# Altium project Flyback.PrjPcb (part 2 of 3)
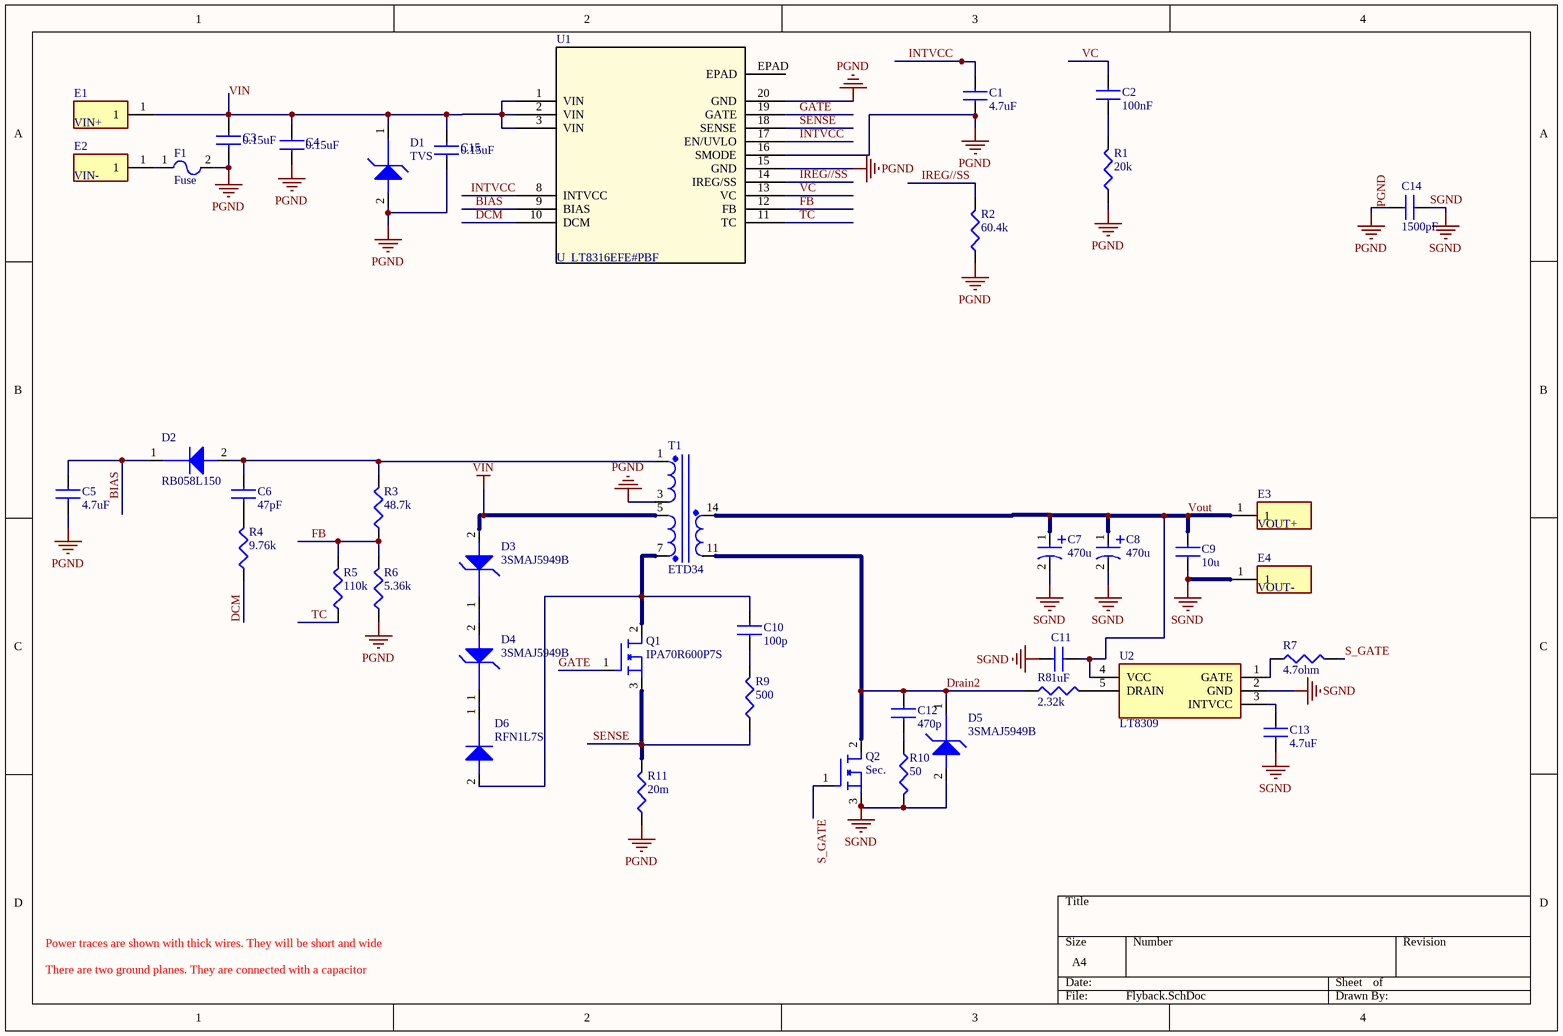
[diagram p1: Flyback.SchDoc]

## Sheet Flyback.SchDoc (continued)
### Library data of the parts
C1 = C_IntVcc: CAP CER 4.7UF 25V X5R 0805 / GRM219R61E475MA73D; Manufacturer: Murata; Tolerance: 20%; Supplier 1: Digi-Key; Supplier Part Number 1: 490-14644-1-ND; Manufacturer Part Number: GRM219R61E475MA73D; RoHS: Yes; Category: Ceramic Capacitors; Stock 1: 107733; Pricing 1: 1=0,28000, 10=0,19400, 50=0,11640, 100=0,09830, 500=0,06728, 1000=0,05951 (USD); Mount: Surface Mount; Case/Package: 0805; Min Operating Temperature: -55°C; Max Operating Temperature: 85°C; Packaging: Tape and Reel; Capacitance: 4.7uF; Voltage Rating: 25V; Voltage Rating (DC): 25V; Dielectric: X5R; Length: 0.079inch; Width: 0.049inch; Thickness: 0.037inch; RoHS Compliant: Yes; ComponentLink1URL: http://search.murata.co.jp/Ceramy/image/img/A01X/G101/ENG/GRM219R61E475MA73-01.pdf?src-supplier=Digi-Key; ComponentLink1Description: http://search.murata.co.jp/Ceramy/image/img/A01X/G101/ENG/GRM219R61E475MA73-01.pdf?src-supplier=Digi-Key; ComponentLink2URL: https://search.murata.co.jp/Ceramy/image/img/A01X/G101/ENG/GRM219R61E475MA73-01.pdf?src-supplier=Digi-Key; ComponentLink2Description: https://search.murata.co.jp/Ceramy/image/img/A01X/G101/ENG/GRM219R61E475MA73-01.pdf?src-supplier=Digi-Key
C2 = C_Vc: CAP CER 0.1UF 25V X7R 0402 / GRM155R71E104KE14J; Manufacturer: Murata; Tolerance: 10%; Supplier 1: Digi-Key; Supplier Part Number 1: 490-14603-1-ND; Manufacturer Part Number: GRM155R71E104KE14J; RoHS: Yes; Category: Capacitors; Stock 1: 1830340; Pricing 1: 1=0,10000, 10=0,02800, 50=0,01520, 100=0,01240, 500=0,00886, 1000=0,00696, 2500=0,00632, 5000=0,00582 (USD); Mount: Surface Mount; Case/Package: 0402; Case Code (Imperial): 0402; Case Code (Metric): 1005; Weight: 0.000212oz; Min Operating Temperature: -55°C; Max Operating Temperature: 125°C; Packaging: Tape and Reel; Capacitance: 100nF; Voltage Rating: 25V; Dielectric: X7R; Termination: SMD/SMT; Resistor Type: Ceramic; Voltage Rating (DC): 25V; Package Quantity: 50000; Length: 0.039inch; Width: 0.5mm; Height: 0.5mm; Thickness: 0.022inch; RoHS Compliant: Yes; ComponentLink1URL: http://www.mouser.com/ds/2/281/c02e-2905.pdf?src-supplier=Mouser; ComponentLink1Description: http://www.mouser.com/ds/2/281/c02e-2905.pdf?src-supplier=Mouser; ComponentLink2URL: http://search.murata.co.jp/Ceramy/image/img/A01X/G101/ENG/GRM155R71E104KE14-01.pdf?src-supplier=Digi-Key; ComponentLink2Description: http://search.murata.co.jp/Ceramy/image/img/A01X/G101/ENG/GRM155R71E104KE14-01.pdf?src-supplier=Digi-Key
C3 C4 C15 = C_Input: CAP CER 0.15UF 500V X7R 1210 / C1210C154KCRACTU; Manufacturer: KEMET; Dielectric Material: Ceramic; Capacitance: 150nF; Tolerance: 10%; Supplier 1: Digi-Key; Supplier Part Number 1: 399-13485-1-ND; Manufacturer Part Number: C1210C154KCRACTU; RoHS: Yes; Category: Ceramic Capacitors; Stock 1: 23364; Pricing 1: 1=0,49000, 10=0,34400, 50=0,26020, 100=0,22660, 500=0,16786, 1000=0,14268 (USD); Mount: Surface Mount; Case/Package: 1210; Case Code (Imperial): 1210; Case Code (Metric): 3225; Min Operating Temperature: -55°C; Max Operating Temperature: 125°C; Dielectric: X7R; Packaging: Tape and Reel; Voltage Rating (DC): 500V; Voltage Rating: 500V; Length: 0.126inch; Width: 0.098inch; Thickness: 0.091inch; RoHS Compliant: Yes; ComponentLink1URL: https://api.kemet.com/component-edge/download/datasheet/C1210C154KCRAC7800.pdf?src-supplier=Digi-Key; ComponentLink1Description: https://api.kemet.com/component-edge/download/datasheet/C1210C154KCRAC7800.pdf?src-supplier=Digi-Key; ComponentLink2URL: http://www.kemet.com/docfinder?Partnumber=C1210C154KCRAC7800&src-supplier=Digi-Key; ComponentLink2Description: http://www.kemet.com/docfinder?Partnumber=C1210C154KCRAC7800&src-supplier=Digi-Key; ComponentLink3URL: http://capacitoredge.kemet.com/capedge2/DataSheet/Datasheet-C1210C154KCRACTU.pdf?pn=C1210C154KCRACTU&src-supplier=Avnet; ComponentLink3Description: http://capacitoredge.kemet.com/capedge2/DataSheet/Datasheet-C1210C154KCRACTU.pdf?pn=C1210C154KCRACTU&src-supplier=Avnet
C5 = C_Bias: CAP CER 4.7UF 35V 10% X5R 0805 / GRM219R6YA475KA73D; Manufacturer: Murata; Material: Ceramic; Supplier 1: Digi-Key; Supplier Part Number 1: 490-7208-1-ND; Manufacturer Part Number: GRM219R6YA475KA73D; RoHS: Yes; Category: Ceramic Capacitors; Stock 1: 73735; Pricing 1: 1=0,26000, 10=0,18100, 50=0,12060, 100=0,10250, 500=0,07234, 1000=0,06330 (USD); Mount: Surface Mount; Case/Package: 0805; Case Code (Metric): 2012; Case Code (Imperial): 0805; Weight: 0.000335oz; Dielectric Material: Ceramic; Min Operating Temperature: -55°C; Max Operating Temperature: 85°C; Voltage Rating: 35V; Tolerance: 10%; Package Quantity: 1; Packaging: Tape and Reel; Capacitance: 4.7uF; Dielectric: X5R; Voltage: 35V; Termination: SMD/SMT; Voltage Rating (DC): 35V; Series: GRM; Length: 2mm; Width: 1.25mm; Height: 0.85mm; Thickness: 0.037inch; Depth: 1.25mm; Lead Free: Lead Free; RoHS Compliant: Yes; ComponentLink1URL: https://datasheet.ciiva.com/14906/partnumbering-e-01-14906486.pdf?src-supplier=Digi-Key; ComponentLink1Description: https://datasheet.ciiva.com/14906/partnumbering-e-01-14906486.pdf?src-supplier=Digi-Key; ComponentLink2URL: https://datasheet.ciiva.com/18697/partnumbering-e-01-18697370.pdf?src-supplier=Digi-Key; ComponentLink2Description: https://datasheet.ciiva.com/18697/partnumbering-e-01-18697370.pdf?src-supplier=Digi-Key
C6 = C_DCM: MURATA - GRM1885C2A470JA01D - SMD Multilayer Ceramic Capacitor, 47 pF, 100 V, 0603 [1608 Metric], ± 5%, C0G / NP0, GRM Series; Voltage Rating: 100V; Temperature Coefficient: 30ppm/°C; Supplier 1: Digi-Key; Supplier Part Number 1: 490-1343-1-ND; Manufacturer: Murata; Manufacturer Part Number: GRM1885C2A470JA01D; RoHS: Yes; Category: Capacitors; Stock 1: 150902; Pricing 1: 1=0,11000, 10=0,07600, 50=0,04340, 100=0,03590, 500=0,02516, 1000=0,02083 (USD); Mount: Surface Mount; Case/Package: 0603; Case Code (Metric): 1608; Case Code (Imperial): 0603; Material: Ceramic; Min Operating Temperature: -55°C; Max Operating Temperature: 125°C; Package Quantity: 1; Capacitance: 47pF; Tolerance: 5%; Packaging: Tape and Reel; Voltage Rating (DC): 100V; Dielectric: C0G; Termination: SMD/SMT; Voltage: 100V; Series: GRM; Construction: Flat; Length: 1.6mm; Width: 0.031inch; Height: 0.8mm; Thickness: 0.035inch; Depth: 0.8mm; Radiation Hardening: No; REACH SVHC: No SVHC; Lead Free: Lead Free; RoHS Compliant: Yes; ComponentLink1URL: https://datasheet.ciiva.com/132/product-132289.pdf?src-supplier=Digi-Key; ComponentLink1Description: https://datasheet.ciiva.com/132/product-132289.pdf?src-supplier=Digi-Key; ComponentLink2URL: https://datasheet.ciiva.com/11786/0900766b80ef921d-11786149.pdf?src-supplier=RSComponents; ComponentLink2Description: https://datasheet.ciiva.com/11786/0900766b80ef921d-11786149.pdf?src-supplier=RSComponents; ComponentLink3URL: https://datasheet.ciiva.com/18101/getdatasheetpartid-37998-18101094.pdf?src-supplier=Verical; ComponentLink3Description: https://datasheet.ciiva.com/18101/getdatasheetpartid-37998-18101094.pdf?src-supplier=Verical; ComponentLink4URL: https://datasheet.ciiva.com/29202/451301-da-01-en-vs-kondensator-0603-29202381.pdf?src-supplier=Conrad; ComponentLink4Description: https://datasheet.ciiva.com/29202/451301-da-01-en-vs-kondensator-0603-29202381.pdf?src-supplier=Conrad; ComponentLink5URL: https://datasheet.ciiva.com/132/partnumbering-e-01-132290.pdf?src-supplier=Digi-Key; ComponentLink5Description: https://datasheet.ciiva.com/132/partnumbering-e-01-132290.pdf?src-supplier=Digi-Key; ComponentLink6URL: https://datasheet.ciiva.com/132/partnumbering-e-01-132291.pdf?src-supplier=Digi-Key; ComponentLink6Description: https://datasheet.ciiva.com/132/partnumbering-e-01-132291.pdf?src-supplier=Digi-Key; ComponentLink7URL: https://datasheet.ciiva.com/5424/product-5424681.pdf?src-supplier=Mouser; ComponentLink7Description: https://datasheet.ciiva.com/5424/product-5424681.pdf?src-supplier=Mouser; ComponentLink8URL: https://datasheet.ciiva.com/11463/product-11463932.pdf?src-supplier=Avnet; ComponentLink8Description: https://datasheet.ciiva.com/11463/product-11463932.pdf?src-supplier=Avnet; ComponentLink9URL: https://datasheet.ciiva.com/16497/product-16497070.pdf?src-supplier=Future+Electronics; ComponentLink9Description: https://datasheet.ciiva.com/16497/product-16497070.pdf?src-supplier=Future+Electronics
C7 C8 = C_OUT_470u: Solid Polymer Aluminum, Radial, Output Capacitor / A750EQ477M1CAAE015; Manufacturer: KEMET; Supplier 1: Digi-Key; Supplier Part Number 1: 399-A750EQ477M1CAAE015-ND; Manufacturer Part Number: A750EQ477M1CAAE015; Stock 1: 1592; Pricing 1: 1=0,53000, 10=0,37700, 50=0,28520, 100=0,24840, 500=0,18400, 1000=0,15640, 2500=0,14720, 5000=0,13800 (USD)
C9 = C_OUT_10u: MURATA - GRM21BR61E106MA73L - SMD Multilayer Ceramic Capacitor, 10 µF, 25 V, 0805 [2012 Metric], ± 20%, X5R, GRM Series; Capacitance: 10uF; Voltage Rating: 25V; Supplier 1: Digi-Key; Supplier Part Number 1: 490-10748-1-ND; Manufacturer: Murata; Manufacturer Part Number: GRM21BR61E106MA73L; RoHS: Yes; Category: Ceramic Capacitors; Stock 1: 350987; Pricing 1: 1=0,26000, 10=0,17900, 50=0,11960, 100=0,10170, 500=0,07176, 1000=0,06279 (USD); Mount: Surface Mount; Case/Package: 0805; Case Code (Metric): 2012; Case Code (Imperial): 0805; Weight: 0.000335oz; Min Operating Temperature: -55°C; Max Operating Temperature: 85°C; Tolerance: 20%; Packaging: Tape and Reel; Dielectric: X5R; Termination: SMD/SMT; Resistor Type: Ceramic; Voltage Rating (DC): 25V; Package Quantity: 3000; Length: 2mm; Width: 0.049inch; Height: 1.25mm; Thickness: 0.055inch; Depth: 1.25mm; REACH SVHC: No SVHC; Lead Free: Lead Free; RoHS Compliant: Yes; ComponentLink1URL: http://www.farnell.com/datasheets/2079185.pdf?src-supplier=Farnell; ComponentLink1Description: http://www.farnell.com/datasheets/2079185.pdf?src-supplier=Farnell; ComponentLink2URL: http://www.mouser.com/ds/2/281/c02e-2905.pdf?src-supplier=Mouser; ComponentLink2Description: http://www.mouser.com/ds/2/281/c02e-2905.pdf?src-supplier=Mouser; ComponentLink3URL: http://components.arrow.com/part/dataview/0323_03061623?src-supplier=Arrow+Europe; ComponentLink3Description: http://components.arrow.com/part/dataview/0323_03061623?src-supplier=Arrow+Europe; ComponentLink4URL: https://search.murata.co.jp/Ceramy/image/img/A01X/G101/ENG/GRM21BR61E106MA73-01.pdf?src-supplier=Digi-Key; ComponentLink4Description: https://search.murata.co.jp/Ceramy/image/img/A01X/G101/ENG/GRM21BR61E106MA73-01.pdf?src-supplier=Digi-Key; ComponentLink5URL: http://www.farnell.com/datasheets/2079185.pdf?src-supplier=Element14; ComponentLink5Description: http://www.farnell.com/datasheets/2079185.pdf?src-supplier=Element14
C10 = C_Snub_Pri: CAP CER 100PF 630V C0G/NP0 1206 / GRM31A5C2J101JW01D; Manufacturer: Murata; Tolerance: 10%; Dielectric: C0G; Voltage: 500V; Temperature Coefficient: 30ppm/°C; Supplier 1: Digi-Key; Supplier Part Number 1: 490-5273-1-ND; Manufacturer Part Number: GRM31A5C2J101JW01D; RoHS: Yes; Category: Ceramic Capacitors; Stock 1: 140494; Pricing 1: 1=0,48000, 10=0,33300, 50=0,23340, 100=0,20000, 500=0,14998, 1000=0,12665 (USD); Mount: Surface Mount; Case/Package: 1206; Case Code (Imperial): 1206; Case Code (Metric): 3216; Min Operating Temperature: -55°C; Max Operating Temperature: 125°C; Capacitance: 100pF; Voltage Rating: 630V; Packaging: Tape and Reel; Voltage Rating (DC): 630V; Package Quantity: 1; Termination: SMD/SMT; Series: GRM; Construction: Flat; Length: 3.2mm; Width: 1.6mm; Height: 1mm; Thickness: 0.039inch; Depth: 1.6mm; Radiation Hardening: No; REACH SVHC: No SVHC; Lead Free: Lead Free; RoHS Compliant: Yes; ComponentLink1URL: https://datasheet.ciiva.com/6173/608985-6173110.pdf?src-supplier=Farnell; ComponentLink1Description: https://datasheet.ciiva.com/6173/608985-6173110.pdf?src-supplier=Farnell; ComponentLink2URL: https://datasheet.ciiva.com/22703/608985-22703466.pdf?src-supplier=Element14; ComponentLink2Description: https://datasheet.ciiva.com/22703/608985-22703466.pdf?src-supplier=Element14; ComponentLink3URL: https://datasheet.ciiva.com/138/partnumbering-e-01-138811.pdf?src-supplier=Digi-Key; ComponentLink3Description: https://datasheet.ciiva.com/138/partnumbering-e-01-138811.pdf?src-supplier=Digi-Key; ComponentLink4URL: https://datasheet.ciiva.com/138/partnumbering-e-01-138812.pdf?src-supplier=Digi-Key; ComponentLink4Description: https://datasheet.ciiva.com/138/partnumbering-e-01-138812.pdf?src-supplier=Digi-Key; ComponentLink5URL: https://datasheet.ciiva.com/138/partnumbering-e-01-138813.pdf?src-supplier=Digi-Key; ComponentLink5Description: https://datasheet.ciiva.com/138/partnumbering-e-01-138813.pdf?src-supplier=Digi-Key; ComponentLink6URL: https://datasheet.ciiva.com/16214/product-16214765.pdf?src-supplier=Future+Electronics; ComponentLink6Description: https://datasheet.ciiva.com/16214/product-16214765.pdf?src-supplier=Future+Electronics
C11 = C_Vcc2: Cap Ceramic 1uF 16V X5R 10% SMD 1206 85°C T/R; Manufacturer: KEMET; Manufacturer Part Number: C1206C105K4PAC7800; Supplier 1: Digi-Key; Supplier Part Number 1: 399-15074-1-ND; RoHS: Yes; Category: Ceramic Capacitors; Stock 1: 698; Pricing 1: 1=0,50000, 10=0,35400, 50=0,26740, 100=0,23290, 500=0,17250, 1000=0,14662 (USD); Mount: Surface Mount; Case/Package: 1206; Min Operating Temperature: -55°C; Max Operating Temperature: 85°C; Packaging: Tape and Reel; Capacitance: 1uF; Tolerance: 10%; Voltage Rating: 16V; RoHS Compliant: Yes; ComponentLink1URL: https://api.kemet.com/component-edge/download/datasheet/C1206C105K4PAC7800.pdf?src-supplier=Digi-Key; ComponentLink1Description: https://api.kemet.com/component-edge/download/datasheet/C1206C105K4PAC7800.pdf?src-supplier=Digi-Key
C12 = C_Snub_Sec: Cap Ceramic 470pF 100V X7R 10% SMD 0402 125C Paper T/R / GRM155R72A471KA01D; Manufacturer: Murata; Supplier 1: Digi-Key; Supplier Part Number 1: 490-6369-1-ND; Manufacturer Part Number: GRM155R72A471KA01D; RoHS: Yes; Category: Ceramic Capacitors; Stock 1: 9964; Pricing 1: 1=0,10000, 10=0,05300, 50=0,02900, 100=0,02370, 500=0,01690, 1000=0,01328, 2500=0,01208, 5000=0,01111 (USD); Mount: Surface Mount; Case/Package: 0402; Case Code (Metric): 1005; Case Code (Imperial): 0402; Min Operating Temperature: -55°C; Max Operating Temperature: 125°C; Capacitance: 470pF; Tolerance: 10%; Package Quantity: 10000; Voltage Rating: 100V; Packaging: Tape and Reel; Voltage Rating (DC): 100V; Dielectric: X7R; Termination: SMD/SMT; Voltage: 100V; Series: GRM; Construction: Flat; Length: 1mm; Width: 0.02inch; Height: 0.5mm; Thickness: 0.022inch; Depth: 0.5mm; Radiation Hardening: No; Lead Free: Lead Free; RoHS Compliant: Yes; ComponentLink1URL: https://datasheet.ciiva.com/6263/product-6263842.pdf?src-supplier=Digi-Key; ComponentLink1Description: https://datasheet.ciiva.com/6263/product-6263842.pdf?src-supplier=Digi-Key; ComponentLink2URL: https://datasheet.ciiva.com/6263/partnumbering-e-01-6263846.pdf?src-supplier=Digi-Key; ComponentLink2Description: https://datasheet.ciiva.com/6263/partnumbering-e-01-6263846.pdf?src-supplier=Digi-Key; ComponentLink3URL: https://datasheet.ciiva.com/11604/product-11604842.pdf?src-supplier=Avnet; ComponentLink3Description: https://datasheet.ciiva.com/11604/product-11604842.pdf?src-supplier=Avnet
C13 = C_IntVcc2: 4.7µF ±10% 10V X7R Ceramic Capacitor -55°C ~ 125°C Surface Mount, MLCC 0805 (2012 Metric) 0.079" L x 0.049" W (2.00mm x 1.25mm); Manufacturer: TDK; Manufacturer Part Number: CGA4J3X7R1A475K125AB; Supplier 1: Digi-Key; Supplier Part Number 1: 445-12730-1-ND; RoHS: Yes; Category: Ceramic Capacitors; Stock 1: 263; Pricing 1: 1=0,27000, 10=0,18200, 50=0,12140, 100=0,10320, 500=0,07286, 1000=0,06376 (USD); Mount: Surface Mount; Case/Package: 0805; Weight: 0.000194oz; Case Code (Imperial): 0805; Case Code (Metric): 2012; Min Operating Temperature: -55°C; Max Operating Temperature: 125°C; Package Quantity: 2000; Packaging: Tape and Reel; Capacitance: 4.7uF; Tolerance: 10%; Voltage Rating: 10V; Dielectric: X7R; Termination: SMD/SMT; Voltage Rating (DC): 10V; Length: 0.079inch; Width: 1.25mm; Height: 1.25mm; Thickness: 0.057inch; Ratings: AEC-Q200; Lead Free: Lead Free; REACH SVHC: No SVHC; ComponentLink1URL: http://www.mouser.com/ds/2/400/lcc_automotive_general_en-843974.pdf?src-supplier=Mouser; ComponentLink1Description: http://www.mouser.com/ds/2/400/lcc_automotive_general_en-843974.pdf?src-supplier=Mouser; ComponentLink2URL: http://www.farnell.com/datasheets/2016103.pdf?src-supplier=Farnell; ComponentLink2Description: http://www.farnell.com/datasheets/2016103.pdf?src-supplier=Farnell; ComponentLink3URL: http://www.farnell.com/datasheets/2016103.pdf?src-supplier=Element14; ComponentLink3Description: http://www.farnell.com/datasheets/2016103.pdf?src-supplier=Element14; ComponentLink4URL: http://product.tdk.com/en/catalog/datasheets/mlcc_automotive_general_en.pdf?src-supplier=Avnet; ComponentLink4Description: http://product.tdk.com/en/catalog/datasheets/mlcc_automotive_general_en.pdf?src-supplier=Avnet; ComponentLink5URL: https://product.tdk.com/info/en/documents/chara_sheet/CGA4J3X7R1A475K125AB.pdf?src-supplier=Digi-Key; ComponentLink5Description: https://product.tdk.com/info/en/documents/chara_sheet/CGA4J3X7R1A475K125AB.pdf?src-supplier=Digi-Key; ComponentLink6URL: https://product.tdk.com/info/en/catalog/datasheets/mlcc_automotive_general_en.pdf?src-supplier=Digi-Key; ComponentLink6Description: https://product.tdk.com/info/en/catalog/datasheets/mlcc_automotive_general_en.pdf?src-supplier=Digi-Key
C14 = C_GND: Ceramic Suppression Cap, 1500PF, X1/Y1 Rohs Compliant: Yes; Manufacturer: Vishay; Manufacturer Part Number: SMDY1152MY5UCR; Supplier 1: Digi-Key; Supplier Part Number 1: 56-SMDY1152MY5UCRTR-ND; Pricing 1: 1000=0,57750 (USD); Category: Capacitors
D1 = D_P4SMA440CA: TVS DIODE 376VWM 602VC SMD; Manufacturer: Littelfuse; Clamping Voltage: 602V; Peak Pulse Power: 400W; Polarity: Bidirectional; Number of Bidirectional Channels: 1; Reverse Standoff Voltage: 376V; Min Breakdown Voltage: 418V; Power Line Protection: No; Peak Pulse Current: 700mA; Max Breakdown Voltage: 462V; Test Current: 1mA; Max Power Dissipation: 3.3W; Leakage Current: 5uA; Voltage Rating (DC): 440V; Diode Type: ZENER; Supplier 1: Digi-Key; Supplier Part Number 1: P4SMA440CACT-ND; Manufacturer Part Number: P4SMA440CA; RoHS: Yes; Category: TVS Diodes; Stock 1: 2778; Pricing 1: 1=0,61000, 10=0,53500, 100=0,41040, 500=0,32444, 1000=0,25955, 2000=0,23522 (USD); Mount: Surface Mount; Case/Package: DO-214AC; Number of Pins: 2; Min Operating Temperature: -65°C; Max Operating Temperature: 150°C; Resistor Type: Zener; Package Quantity: 5000; Direction: Bidirectional; Operating Supply Voltage: 376V; Max Surge Current: 700mA; Packaging: Tape and Reel; Reverse Breakdown Voltage: 418V; Breakdown Voltage: 418V; Number of Channels: 1; Termination: SMD/SMT; Power Dissipation: 400W; Number of Elements: 1; Series: P4SMA; Clamping Voltage-Max: 602V; Length: 5.28mm; Width: 2.79mm; Height: 2.29mm; RoHS Compliant: Yes; REACH SVHC: Unknown; Lead Free: Lead Free; ComponentLink1URL: https://datasheet.ciiva.com/16473/littelfuse-tvs-diodes-p4sma-16473648.pdf?src-supplier=Future+Electronics; ComponentLink1Description: https://datasheet.ciiva.com/16473/littelfuse-tvs-diodes-p4sma-16473648.pdf?src-supplier=Future+Electronics; ComponentLink2URL: https://datasheet.ciiva.com/341/littelfuse-tvs-diode-p4sma-datasheet-pdf-341159.pdf?src-supplier=Digi-Key; ComponentLink2Description: https://datasheet.ciiva.com/341/littelfuse-tvs-diode-p4sma-datasheet-pdf-341159.pdf?src-supplier=Digi-Key; ComponentLink3URL: https://datasheet.ciiva.com/8062/littelfuse-tvs-diodes-p4sma-8062188.pdf?src-supplier=Element14; ComponentLink3Description: https://datasheet.ciiva.com/8062/littelfuse-tvs-diodes-p4sma-8062188.pdf?src-supplier=Element14; ComponentLink4URL: https://datasheet.ciiva.com/341/littelfuse-tvs-diode-p4sma-datasheet-pdf-341160.pdf?src-supplier=Digi-Key; ComponentLink4Description: https://datasheet.ciiva.com/341/littelfuse-tvs-diode-p4sma-datasheet-pdf-341160.pdf?src-supplier=Digi-Key
D2 = D_RB058LAM150TR: Schottky Barrier Diode for general rectification Diode for Bias Pin; Manufacturer: Rohm; Supplier 1: Digi-Key; Supplier Part Number 1: RB058LAM150CT-ND; Manufacturer Part Number: RB058LAM150TR; RoHS: Yes; Stock 1: 50; Pricing 1: 1=0,45000, 10=0,34000, 100=0,21190, 500=0,14500, 1000=0,11154 (USD); RoHS Compliant: Yes; ComponentLink1URL: http://www.farnell.com/datasheets/2646192.pdf?src-supplier=Farnell; ComponentLink1Description: http://www.farnell.com/datasheets/2646192.pdf?src-supplier=Farnell; ComponentLink2URL: http://www.farnell.com/datasheets/2646192.pdf?src-supplier=Element14; ComponentLink2Description: http://www.farnell.com/datasheets/2646192.pdf?src-supplier=Element14; ComponentLink3URL: http://www.farnell.com/datasheets/2646192.pdf?src-supplier=Newark; ComponentLink3Description: http://www.farnell.com/datasheets/2646192.pdf?src-supplier=Newark
D3-D5 = D_3SMAJ5949B-TP: DIODE ZENER 100V 3W DO214AC / 3SMAJ5949B-TPMSCT-ND; Manufacturer: MCC; Tolerance: 5%; Impedance: 250R; Supplier 1: Digi-Key; Supplier Part Number 1: 3SMAJ5949B-TPMSCT-ND; Manufacturer Part Number: 3SMAJ5949B-TP; RoHS: Yes; Category: Zener Diodes; Stock 1: 860; Pricing 1: 1=0,51000, 10=0,41400, 100=0,28160, 500=0,21120, 1000=0,15840, 2000=0,14520 (USD); Mount: Surface Mount; Min Operating Temperature: -55°C; Max Operating Temperature: 150°C; Packaging: Tape and Reel; Package Quantity: 1; Zener Voltage: 100V; Max Power Dissipation: 3W; Series: 3SMAJ594; RoHS Compliant: Yes; ComponentLink1URL: https://datasheet.ciiva.com/6389/3smaj5913b3smaj5956bdo-214ac-6389951.pdf?src-supplier=Digi-Key; ComponentLink1Description: https://datasheet.ciiva.com/6389/3smaj5913b3smaj5956bdo-214ac-6389951.pdf?src-supplier=Digi-Key; ComponentLink2URL: https://datasheet.ciiva.com/6389/3smaj5913b3smaj5956bdo-214ac-6389949.pdf?src-supplier=Digi-Key; ComponentLink2Description: https://datasheet.ciiva.com/6389/3smaj5913b3smaj5956bdo-214ac-6389949.pdf?src-supplier=Digi-Key; ComponentLink3URL: https://datasheet.ciiva.com/6389/3smaj5913b3smaj5956bdo-214ac-6389950.pdf?src-supplier=Digi-Key; ComponentLink3Description: https://datasheet.ciiva.com/6389/3smaj5913b3smaj5956bdo-214ac-6389950.pdf?src-supplier=Digi-Key
D6 = D_RFN1L7SDDTE25: Clamp circuit fast diode; Manufacturer: Rohm; Supplier 1: Digi-Key; Supplier Part Number 1: 846-RFN1L7SDDTE25TR-ND; Manufacturer Part Number: RFN1L7SDDTE25; RoHS: Yes
E1-E4 = Connector: TERM TURRET SINGLE L=5.56MM TIN / 2501-2-00-80-00-00-07-0; Manufacturer: Mill-Max; Gender: Male; Outside Diameter: 3.18mm; Hole Diameter: 0.094inch; Board Thickness: 1.57mm; Mounting Hole Diameter: 2.39mm; Pin Diameter: 0.047inch; Supplier 1: Digi-Key; Supplier Part Number 1: ED90581-ND; Manufacturer Part Number: 2501-2-00-80-00-00-07-0; RoHS: Yes; Category: Terminals; Stock 1: 4209; Pricing 1: 1=0,23000, 10=0,21400, 25=0,18240, 50=0,15940, 100=0,14810, 250=0,13100, 500=0,12530, 1000=0,10252, 2500=0,09397 (USD); Mount: Through Hole; Material: Brass; Plating: Tin; Package Quantity: 500; Packaging: Bulk; Length: 0.328inch; Lead Free: Lead Free; RoHS Compliant: Yes; ComponentLink1URL: https://datasheet.ciiva.com/12487/2501-2-00-80-00-00-07-0-89719-12487471.pdf?src-supplier=Mouser; ComponentLink1Description: https://datasheet.ciiva.com/12487/2501-2-00-80-00-00-07-0-89719-12487471.pdf?src-supplier=Mouser
F1 = Fuse_0751.0110: FUSE CLIP CARTRIDGE 10A PCB / 0751.0110; Manufacturer: Schurter; Material: Bronze,Tin,Brass; Color: Silver; Body Material: Brass; Current Rating: 6.3A; Voltage Rating (DC): 500V; Voltage Rating: 250V; Number of Circuits: 1; Supplier 1: Digi-Key; Supplier Part Number 1: 486-2019-ND; Manufacturer Part Number: 0751.0110; RoHS: Yes; Category: Fuse Holders; Stock 1: 21388; Pricing 1: 1=0,14000, 50=0,10800, 100=0,09700, 500=0,07300, 1000=0,06384 (USD); Mount: Horizontal,PCB,Through Hole; Contact Plating: Tin; Weight: 0.011288oz; Contact Material: Brass; Min Operating Temperature: -40°C; Max Operating Temperature: 85°C; Packaging: Bulk; Voltage Rating (AC): 500V; Package Quantity: 1000; Termination: PC Pin; Voltage: 500V; Fuse Current: 6.3A; Orientation: Horizontal; Length: 5.6mm; Width: 5.6mm; Height: 8.9mm; Depth: 5mm; Radiation Hardening: No; Lead Free: Lead Free; REACH SVHC: No SVHC; ComponentLink1URL: https://datasheet.ciiva.com/16216/629typ-og-clip-5x20-16216705.pdf?src-supplier=Onlinecomponents.com; ComponentLink1Description: https://datasheet.ciiva.com/16216/629typ-og-clip-5x20-16216705.pdf?src-supplier=Onlinecomponents.com; ComponentLink2URL: https://datasheet.ciiva.com/26828/getdatasheetpartid-474345-26828915.pdf?src-supplier=Verical; ComponentLink2Description: https://datasheet.ciiva.com/26828/getdatasheetpartid-474345-26828915.pdf?src-supplier=Verical; ComponentLink3URL: https://datasheet.ciiva.com/14102/zoog-clip-5x20-e-14102795.pdf?src-supplier=Distrelec; ComponentLink3Description: https://datasheet.ciiva.com/14102/zoog-clip-5x20-e-14102795.pdf?src-supplier=Distrelec; ComponentLink4URL: https://datasheet.ciiva.com/30148/54typ-og-clip-5x20-30148507.pdf?src-supplier=Onlinecomponents.com; ComponentLink4Description: https://datasheet.ciiva.com/30148/54typ-og-clip-5x20-30148507.pdf?src-supplier=Onlinecomponents.com; ComponentLink5URL: https://datasheet.ciiva.com/4480/typ-og-clip-5x20-4480442.pdf?src-supplier=Mouser; ComponentLink5Description: https://datasheet.ciiva.com/4480/typ-og-clip-5x20-4480442.pdf?src-supplier=Mouser; ComponentLink6URL: https://datasheet.ciiva.com/3014/typ-og-clip-5x20-3014524.pdf?src-supplier=Avnet; ComponentLink6Description: https://datasheet.ciiva.com/3014/typ-og-clip-5x20-3014524.pdf?src-supplier=Avnet; ComponentLink7URL: https://datasheet.ciiva.com/8036/1712870-8036524.pdf?src-supplier=Element14; ComponentLink7Description: https://datasheet.ciiva.com/8036/1712870-8036524.pdf?src-supplier=Element14; ComponentLink8URL: https://datasheet.ciiva.com/16535/typ-og-clip-5x20-16535885.pdf?src-supplier=Avnet+Europe; ComponentLink8Description: https://datasheet.ciiva.com/16535/typ-og-clip-5x20-16535885.pdf?src-supplier=Avnet+Europe; ComponentLink9URL: https://datasheet.ciiva.com/16326/typ-og-clip-5x20-16326863.pdf?src-supplier=Future+Electronics; ComponentLink9Description: https://datasheet.ciiva.com/16326/typ-og-clip-5x20-16326863.pdf?src-supplier=Future+Electronics
Q1 = Q_IPA70R600P7SXKSA1: Single N-Channel 700V 600 mOhm 10.5 nC CoolMOS Power Mosfet - TO-220-3FP; Manufacturer: Infineon; Continuous Drain Current (ID): 8.5A; Rds On Max: 600mR; Input Capacitance: 364pF; Max Power Dissipation: 25W; Supplier 1: Digi-Key; Supplier Part Number 1: IPA70R600P7SXKSA1-ND; Manufacturer Part Number: IPA70R600P7SXKSA1; RoHS: Yes; Category: MOSFETs; Stock 1: 111; Pricing 1: 1=1,03000, 10=0,91700, 25=0,87000, 100=0,71470, 500=0,59038, 1000=0,47285 (USD); Mount: Through Hole; Case/Package: TO-220-3; Min Operating Temperature: -40°C; Max Operating Temperature: 150°C; Max Dual Supply Voltage: 700V; Drain to Source Voltage (Vdss): 700V; Packaging: Rail/Tube; Lead Free: Lead Free; Halogen Free: Halogen Free; RoHS Compliant: Yes; ComponentLink1URL: https://www.infineon.com/dgdl/Infineon-IPA70R600P7S-DS-v02_00-EN.pdf?fileId=5546d462584d1d4a0158cf80e8880d96&src-supplier=Digi-Key; ComponentLink1Description: https://www.infineon.com/dgdl/Infineon-IPA70R600P7S-DS-v02_00-EN.pdf?fileId=5546d462584d1d4a0158cf80e8880d96&src-supplier=Digi-Key
Q2 = Q_BSC040N10NS5ATMA1: INFINEON - BSC040N10NS5ATMA1 - MOSFET, N-KANAL, 100V, 100A, TDSON; Rds On Max: 4mR; Input Capacitance: 5.3nF; Max Power Dissipation: 2.5W; Turn-On Delay Time: 13ns; Rise Time: 9ns; Turn-Off Delay Time: 32ns; Fall Time: 10ns; Gate to Source Voltage (Vgs): 20V; Element Configuration: Single; Number of Channels: 1; Drain to Source Resistance: 5.6mR; Supplier 1: Digi-Key; Supplier Part Number 1: BSC040N10NS5ATMA1CT-ND; Manufacturer: Infineon; Manufacturer Part Number: BSC040N10NS5ATMA1; RoHS: Yes; Category: MOSFETs; Stock 1: 130; Pricing 1: 1=3,10000, 10=2,78200, 25=2,62480, 100=2,23650, 500=1,83750, 1000=1,75000 (USD); Mount: Surface Mount; Number of Pins: 8; Weight: 0.01787oz; Min Operating Temperature: -55°C; Max Operating Temperature: 150°C; Packaging: Tape and Reel; Drain to Source Voltage (Vdss): 100V; Continuous Drain Current (ID): 100A; Drain to Source Breakdown Voltage: 100V; Package Quantity: 5000; Max Dual Supply Voltage: 100V; RoHS Compliant: Yes; Lead Free: Contains Lead; Halogen Free: Halogen Free; ComponentLink1URL: http://www.mouser.com/ds/2/196/Infineon-BSC040N10NS5-DS-v02_01-EN-531313.pdf?src-supplier=Mouser; ComponentLink1Description: http://www.mouser.com/ds/2/196/Infineon-BSC040N10NS5-DS-v02_01-EN-531313.pdf?src-supplier=Mouser; ComponentLink2URL: http://www.farnell.com/datasheets/2211525.pdf?src-supplier=Farnell; ComponentLink2Description: http://www.farnell.com/datasheets/2211525.pdf?src-supplier=Farnell; ComponentLink3URL: https://www.infineon.com/dgdl/Infineon-BSC040N10NS5-DS-v02_01-EN.pdf?fileId=5546d4624a0bf290014a0fbcee2e6b38&src-supplier=Digi-Key; ComponentLink3Description: https://www.infineon.com/dgdl/Infineon-BSC040N10NS5-DS-v02_01-EN.pdf?fileId=5546d4624a0bf290014a0fbcee2e6b38&src-supplier=Digi-Key; ComponentLink4URL: http://www.infineon.com/dgdl/Infineon-BSC040N10NS5-DS-v02_01-EN.pdf?fileId=5546d4624a0bf290014a0fbcee2e6b38&src-supplier=Digi-Key; ComponentLink4Description: http://www.infineon.com/dgdl/Infineon-BSC040N10NS5-DS-v02_01-EN.pdf?fileId=5546d4624a0bf290014a0fbcee2e6b38&src-supplier=Digi-Key; ComponentLink5URL: http://www.infineon.com/dgdl/Infineon-BSC040N10NS5-DS-v02_00-EN.pdf?fileId=5546d4624a0bf290014a0fbcee2e6b38&src-supplier=Avnet; ComponentLink5Description: http://www.infineon.com/dgdl/Infineon-BSC040N10NS5-DS-v02_00-EN.pdf?fileId=5546d4624a0bf290014a0fbcee2e6b38&src-supplier=Avnet
R1 = R_CVc: D11/CRCW0603-C 100 20K 1% ET1 / CRCW060320K0FKEAC; Manufacturer: Vishay; Power Rating: 100mW; Resistance: 20kR; Temperature Coefficient: 100ppm/°C; Supplier 1: Digi-Key; Supplier Part Number 1: 541-3987-1-ND; Manufacturer Part Number: CRCW060320K0FKEAC; RoHS: Yes; Category: Resistors; Stock 1: 87681; Pricing 1: 1=0,10000, 10=0,03600, 100=0,01450, 1000=0,00652, 2500=0,00566 (USD); Mount: Surface Mount; Case/Package: Molded; Contact Plating: Tin; Min Operating Temperature: -55°C; Max Operating Temperature: 155°C; Tolerance: 1%; Resistor Type: Thick Film; Termination: Wraparound; Length: 1.55mm; Lead Free: Lead Free; RoHS Compliant: Yes; ComponentLink1URL: http://www.vishay.com/docs/28773/crcwce3.pdf?src-supplier=Digi-Key; ComponentLink1Description: http://www.vishay.com/docs/28773/crcwce3.pdf?src-supplier=Digi-Key
R2 = R_IREG//SS: VISHAY - CRCW060360K4FKEA - SMD Chip Resistor, 0603 [1608 Metric], 60.4 kohm, CRCW e3 Series, 75 V, Thick Film, 100 mW; Voltage Rating: 75V; Resistance: 60.4kR; Power Rating: 100mW; Tolerance: 1%; Temperature Coefficient: 100ppm/°C; Supplier 1: Digi-Key; Supplier Part Number 1: 541-60.4KHCT-ND; Manufacturer: Vishay; Manufacturer Part Number: CRCW060360K4FKEA; RoHS: Yes; Category: Resistors; Stock 1: 3660; Pricing 1: 1=0,10000, 10=0,03600, 100=0,01450, 1000=0,00652, 2500=0,00566 (USD); Case/Package: 0603; Weight: 7.1E-05oz; Case Code (Metric): 1608; Case Code (Imperial): 0603; Contact Plating: Tin; Size Code: 0603; Min Operating Temperature: -55°C; Max Operating Temperature: 155°C; Packaging: Tape and Reel; Package Quantity: 10; Resistor Type: Thick Film; Number of Terminations: 2; Termination: SMD/SMT; Max Power Dissipation: 100mW; Voltage Rating (DC): 75V; Features: Automotive AEC-Q200; Series: CRCW; Resistance Tolerance: 1%; Technology: THICK FILM; Construction: Rectangular; Length: 1.55mm; Width: 0.033inch; Height: 0.45mm; Depth: 0.85mm; Radiation Hardening: No; REACH SVHC: Unknown; Military Standard: Not; Lead Free: Lead Free; RoHS Compliant: Yes; ComponentLink1URL: https://datasheet.ciiva.com/11809/0900766b80d98afc-11809685.pdf?src-supplier=RSComponents; ComponentLink1Description: https://datasheet.ciiva.com/11809/0900766b80d98afc-11809685.pdf?src-supplier=RSComponents; ComponentLink2URL: https://datasheet.ciiva.com/7816/1697337-7816053.pdf?src-supplier=Element14; ComponentLink2Description: https://datasheet.ciiva.com/7816/1697337-7816053.pdf?src-supplier=Element14; ComponentLink3URL: https://datasheet.ciiva.com/2494/dcrcwe3-2494471.pdf?src-supplier=Digi-Key; ComponentLink3Description: https://datasheet.ciiva.com/2494/dcrcwe3-2494471.pdf?src-supplier=Digi-Key; ComponentLink4URL: https://datasheet.ciiva.com/16760/70201119-16760503.pdf?src-supplier=Allied+Electronics; ComponentLink4Description: https://datasheet.ciiva.com/16760/70201119-16760503.pdf?src-supplier=Allied+Electronics; ComponentLink5URL: https://datasheet.ciiva.com/2494/dcrcwe3-2494472.pdf?src-supplier=Digi-Key; ComponentLink5Description: https://datasheet.ciiva.com/2494/dcrcwe3-2494472.pdf?src-supplier=Digi-Key; ComponentLink6URL: https://datasheet.ciiva.com/16391/dcrcwe3-16391304.pdf?src-supplier=Future+Electronics; ComponentLink6Description: https://datasheet.ciiva.com/16391/dcrcwe3-16391304.pdf?src-supplier=Future+Electronics; ComponentLink7URL: https://datasheet.ciiva.com/16893/dcrcwe3-16893592.pdf?src-supplier=Avnet+Europe; ComponentLink7Description: https://datasheet.ciiva.com/16893/dcrcwe3-16893592.pdf?src-supplier=Avnet+Europe; ComponentLink8URL: https://datasheet.ciiva.com/2494/dcrcwe3-2494473.pdf?src-supplier=Digi-Key; ComponentLink8Description: https://datasheet.ciiva.com/2494/dcrcwe3-2494473.pdf?src-supplier=Digi-Key; ComponentLink9URL: https://datasheet.ciiva.com/5545/dcrcwe3-109170-5545721.pdf?src-supplier=Mouser; ComponentLink9Description: https://datasheet.ciiva.com/5545/dcrcwe3-109170-5545721.pdf?src-supplier=Mouser; ComponentLink10URL: https://datasheet.ciiva.com/3257/dcrcwe3-3257786.pdf?src-supplier=Avnet; ComponentLink10Description: https://datasheet.ciiva.com/3257/dcrcwe3-3257786.pdf?src-supplier=Avnet; ComponentLink11URL: https://datasheet.ciiva.com/22676/1847332-22676330.pdf?src-supplier=Element14; ComponentLink11Description: https://datasheet.ciiva.com/22676/1847332-22676330.pdf?src-supplier=Element14; ComponentLink12URL: https://datasheet.ciiva.com/3257/dcrcwe3-3257787.pdf?src-supplier=Avnet; ComponentLink12Description: https://datasheet.ciiva.com/3257/dcrcwe3-3257787.pdf?src-supplier=Avnet
R3 = R_FB1: Res Thick Film 0603 48.7K Ohm 1% 0.1W(1/10W) ±100ppm/C Pad SMD Automotive T/R / CRCW060348K7FKEA; Manufacturer: Vishay; Resistance: 48.7kR; Power Rating: 100mW; Voltage Rating: 75V; Temperature Coefficient: 100ppm/°C; Supplier 1: Digi-Key; Supplier Part Number 1: 541-48.7KHCT-ND; Manufacturer Part Number: CRCW060348K7FKEA; RoHS: Yes; Category: Resistors; Stock 1: 2623; Pricing 1: 1=0,10000, 10=0,03600, 100=0,01450, 1000=0,00652, 2500=0,00566 (USD); Case/Package: 0603; Number of Pins: 2; Weight: 7.1E-05oz; Case Code (Metric): 1608; Case Code (Imperial): 0603; Contact Plating: Tin; Size Code: 0603; Min Operating Temperature: -55°C; Max Operating Temperature: 155°C; Package Quantity: 10; Tolerance: 1%; Packaging: Tape and Reel; Resistor Type: Thick Film; Number of Terminations: 2; Termination: SMD/SMT; Max Power Dissipation: 100mW; Features: Automotive AEC-Q200; Series: CRCW; Resistance Tolerance: 1%; Technology: THICK FILM; Construction: Rectangular; Length: 1.55mm; Width: 0.033inch; Height: 0.45mm; Depth: 0.85mm; Radiation Hardening: No; REACH SVHC: Unknown; Military Standard: Not; RoHS Compliant: Yes; ComponentLink1URL: https://datasheet.ciiva.com/3882/41397335s9853079n6892-3882805.pdf?src-supplier=Arrow+Electronics; ComponentLink1Description: https://datasheet.ciiva.com/3882/41397335s9853079n6892-3882805.pdf?src-supplier=Arrow+Electronics; ComponentLink2URL: https://datasheet.ciiva.com/11809/0900766b80d98afc-11809590.pdf?src-supplier=RSComponents; ComponentLink2Description: https://datasheet.ciiva.com/11809/0900766b80d98afc-11809590.pdf?src-supplier=RSComponents; ComponentLink3URL: https://datasheet.ciiva.com/2466/dcrcwe3-2466288.pdf?src-supplier=Digi-Key; ComponentLink3Description: https://datasheet.ciiva.com/2466/dcrcwe3-2466288.pdf?src-supplier=Digi-Key; ComponentLink4URL: https://datasheet.ciiva.com/2466/dcrcwe3-2466289.pdf?src-supplier=Digi-Key; ComponentLink4Description: https://datasheet.ciiva.com/2466/dcrcwe3-2466289.pdf?src-supplier=Digi-Key; ComponentLink5URL: https://datasheet.ciiva.com/16781/70201119-16781510.pdf?src-supplier=Allied+Electronics; ComponentLink5Description: https://datasheet.ciiva.com/16781/70201119-16781510.pdf?src-supplier=Allied+Electronics; ComponentLink6URL: https://datasheet.ciiva.com/7816/1697337-7816039.pdf?src-supplier=Element14; ComponentLink6Description: https://datasheet.ciiva.com/7816/1697337-7816039.pdf?src-supplier=Element14; ComponentLink7URL: https://datasheet.ciiva.com/16449/dcrcwe3-16449495.pdf?src-supplier=Future+Electronics; ComponentLink7Description: https://datasheet.ciiva.com/16449/dcrcwe3-16449495.pdf?src-supplier=Future+Electronics; ComponentLink8URL: https://datasheet.ciiva.com/7816/1697337-7816040.pdf?src-supplier=Element14; ComponentLink8Description: https://datasheet.ciiva.com/7816/1697337-7816040.pdf?src-supplier=Element14; ComponentLink9URL: https://datasheet.ciiva.com/16884/dcrcwe3-16884570.pdf?src-supplier=Avnet+Europe; ComponentLink9Description: https://datasheet.ciiva.com/16884/dcrcwe3-16884570.pdf?src-supplier=Avnet+Europe; ComponentLink10URL: https://datasheet.ciiva.com/5551/dcrcwe3-109170-5551868.pdf?src-supplier=Mouser; ComponentLink10Description: https://datasheet.ciiva.com/5551/dcrcwe3-109170-5551868.pdf?src-supplier=Mouser; ComponentLink11URL: https://datasheet.ciiva.com/3257/dcrcwe3-3257645.pdf?src-supplier=Avnet; ComponentLink11Description: https://datasheet.ciiva.com/3257/dcrcwe3-3257645.pdf?src-supplier=Avnet; ComponentLink12URL: https://datasheet.ciiva.com/22705/1697337-22705853.pdf?src-supplier=Element14; ComponentLink12Description: https://datasheet.ciiva.com/22705/1697337-22705853.pdf?src-supplier=Element14; ComponentLink13URL: https://datasheet.ciiva.com/2466/dcrcwe3-2466287.pdf?src-supplier=Digi-Key; ComponentLink13Description: https://datasheet.ciiva.com/2466/dcrcwe3-2466287.pdf?src-supplier=Digi-Key
R4 = R_DCM: Vishay CRCW Series Thick Film Surface Mount Resistor 0603 Case 9.76k 1% 0.1W 100ppm/K / CRCW06039K76FKEA; Resistance: 9.76kR; Power Rating: 100mW; Voltage Rating: 75V; Temperature Coefficient: 100ppm/°C; Supplier 1: Digi-Key; Supplier Part Number 1: 541-9.76KHCT-ND; Manufacturer: Vishay; Manufacturer Part Number: CRCW06039K76FKEA; RoHS: Yes; Category: Chip SMD Resistors; Stock 1: 4468; Pricing 1: 1=0,10000, 10=0,03600, 100=0,01450, 1000=0,00652, 2500=0,00566 (USD); Case/Package: 0603; Weight: 7.1E-05oz; Case Code (Imperial): 0603; Case Code (Metric): 1608; Contact Plating: Tin; Size Code: 0603; Min Operating Temperature: -55°C; Max Operating Temperature: 155°C; Tolerance: 1%; Packaging: Tape and Reel; Package Quantity: 10; Resistor Type: Thick Film; Number of Terminations: 2; Max Power Dissipation: 100mW; Voltage Rating (DC): 75V; Features: Automotive AEC-Q200; Series: CRCW; Resistance Tolerance: 1%; Construction: Rectangular; Termination: SMD/SMT; Technology: THICK FILM; Length: 1.55mm; Width: 0.85mm; Height: 0.45mm; Depth: 0.85mm; Radiation Hardening: No; REACH SVHC: Unknown; Military Standard: Not; Lead Free: Lead Free; RoHS Compliant: Yes; ComponentLink1URL: https://datasheet.ciiva.com/22872/70201119-22872343.pdf?src-supplier=Allied+Electronics; ComponentLink1Description: https://datasheet.ciiva.com/22872/70201119-22872343.pdf?src-supplier=Allied+Electronics; ComponentLink2URL: https://datasheet.ciiva.com/7792/125364-7792443.pdf?src-supplier=Element14; ComponentLink2Description: https://datasheet.ciiva.com/7792/125364-7792443.pdf?src-supplier=Element14; ComponentLink3URL: https://datasheet.ciiva.com/2466/dcrcwe3-2466253.pdf?src-supplier=Digi-Key; ComponentLink3Description: https://datasheet.ciiva.com/2466/dcrcwe3-2466253.pdf?src-supplier=Digi-Key; ComponentLink4URL: https://datasheet.ciiva.com/7673/1697337-7673325.pdf?src-supplier=Element14; ComponentLink4Description: https://datasheet.ciiva.com/7673/1697337-7673325.pdf?src-supplier=Element14; ComponentLink5URL: https://datasheet.ciiva.com/7673/1697337-7673326.pdf?src-supplier=Element14; ComponentLink5Description: https://datasheet.ciiva.com/7673/1697337-7673326.pdf?src-supplier=Element14; ComponentLink6URL: https://datasheet.ciiva.com/22702/1697337-22702901.pdf?src-supplier=Element14; ComponentLink6Description: https://datasheet.ciiva.com/22702/1697337-22702901.pdf?src-supplier=Element14; ComponentLink7URL: https://datasheet.ciiva.com/5541/dcrcwe3-109170-5541193.pdf?src-supplier=Mouser; ComponentLink7Description: https://datasheet.ciiva.com/5541/dcrcwe3-109170-5541193.pdf?src-supplier=Mouser; ComponentLink8URL: https://datasheet.ciiva.com/2466/dcrcwe3-2466251.pdf?src-supplier=Digi-Key; ComponentLink8Description: https://datasheet.ciiva.com/2466/dcrcwe3-2466251.pdf?src-supplier=Digi-Key; ComponentLink9URL: https://datasheet.ciiva.com/2466/dcrcwe3-2466252.pdf?src-supplier=Digi-Key; ComponentLink9Description: https://datasheet.ciiva.com/2466/dcrcwe3-2466252.pdf?src-supplier=Digi-Key
R5 = R_Tc: RES SMD 110K OHM 5% 1/10W 0603 / CRCW0603110KJNEA; Manufacturer: Vishay Dale; Resistance: 110kR; Power Rating: 100mW; Voltage Rating: 75V; Temperature Coefficient: 200ppm/°C; Supplier 1: Digi-Key; Supplier Part Number 1: 541-110KGCT-ND; Manufacturer Part Number: CRCW0603110KJNEA; RoHS: Yes; Category: Resistors; Stock 1: 16475; Pricing 1: 1=0,10000, 10=0,03200, 100=0,01310, 1000=0,00588, 2500=0,00510 (USD); Case/Package: 0603; Weight: 7.1E-05oz; Case Code (Imperial): 0603; Case Code (Metric): 1608; Contact Plating: Tin; Min Operating Temperature: -55°C; Max Operating Temperature: 155°C; Tolerance: 5%; Packaging: Tape and Reel; Package Quantity: 1; Termination: SMD/SMT; Resistor Type: Thick Film; Number of Terminations: 2; Max Power Dissipation: 100mW; Voltage Rating (DC): 75V; Features: Automotive AEC-Q200; Series: CRCW; Construction: Rectangular; Length: 1.55mm; Width: 0.85mm; Height: 0.02inch; Depth: 0.85mm; Radiation Hardening: No; Military Standard: Not; Lead Free: Lead Free; RoHS Compliant: Yes; ComponentLink1URL: https://datasheet.ciiva.com/3256/dcrcwe3-3256965.pdf?src-supplier=Avnet; ComponentLink1Description: https://datasheet.ciiva.com/3256/dcrcwe3-3256965.pdf?src-supplier=Avnet; ComponentLink2URL: https://datasheet.ciiva.com/5549/dcrcwe3-109170-5549509.pdf?src-supplier=Mouser; ComponentLink2Description: https://datasheet.ciiva.com/5549/dcrcwe3-109170-5549509.pdf?src-supplier=Mouser; ComponentLink3URL: https://datasheet.ciiva.com/2493/dcrcwe3-2493661.pdf?src-supplier=Digi-Key; ComponentLink3Description: https://datasheet.ciiva.com/2493/dcrcwe3-2493661.pdf?src-supplier=Digi-Key; ComponentLink4URL: https://datasheet.ciiva.com/2493/dcrcwe3-2493662.pdf?src-supplier=Digi-Key; ComponentLink4Description: https://datasheet.ciiva.com/2493/dcrcwe3-2493662.pdf?src-supplier=Digi-Key; ComponentLink5URL: https://datasheet.ciiva.com/2493/dcrcwe3-2493663.pdf?src-supplier=Digi-Key; ComponentLink5Description: https://datasheet.ciiva.com/2493/dcrcwe3-2493663.pdf?src-supplier=Digi-Key
R6 = R_FB2: VISHAY         CRCW06035K36FKEA.             SMD Chip Resistor, Thick Film, 5.36 kohm, 75 V, 0603 [1608 Metric], 100 mW,  1%, CRCW Series; Power Rating: 100mW; Voltage Rating: 75V; Resistance: 5.36kR; Temperature Coefficient: 100ppm/°C; Supplier 1: Digi-Key; Supplier Part Number 1: 541-5.36KHCT-ND; Manufacturer: Vishay; Manufacturer Part Number: CRCW06035K36FKEA; RoHS: Yes; Category: Resistors; Stock 1: 42; Pricing 1: 1=0,10000, 10=0,03600, 100=0,01450, 1000=0,00652, 2500=0,00566 (USD); Case/Package: 0603; Number of Pins: 2; Weight: 7.1E-05oz; Case Code (Imperial): 0603; Case Code (Metric): 1608; Contact Plating: Tin; Size Code: 0603; Min Operating Temperature: -55°C; Max Operating Temperature: 155°C; Tolerance: 1%; Packaging: Tape and Reel; Package Quantity: 5000; Resistor Type: Thick Film; Termination: SMD/SMT; Voltage Rating (DC): 75V; Features: Automotive AEC-Q200; Series: CRCW; Max Power Dissipation: 100mW; Number of Terminations: 2; Construction: Rectangular; Technology: THICK FILM; Resistance Tolerance: 1%; Length: 1.55mm; Width: 0.85mm; Height: 0.45mm; Depth: 0.85mm; Radiation Hardening: No; REACH SVHC: No SVHC; Military Standard: Not; Lead Free: Lead Free; RoHS Compliant: Yes; ComponentLink1URL: https://datasheet.ciiva.com/3257/dcrcwe3-3257765.pdf?src-supplier=Avnet; ComponentLink1Description: https://datasheet.ciiva.com/3257/dcrcwe3-3257765.pdf?src-supplier=Avnet; ComponentLink2URL: https://datasheet.ciiva.com/7679/1697337-7679125.pdf?src-supplier=Element14; ComponentLink2Description: https://datasheet.ciiva.com/7679/1697337-7679125.pdf?src-supplier=Element14; ComponentLink3URL: https://datasheet.ciiva.com/7679/1697337-7679126.pdf?src-supplier=Element14; ComponentLink3Description: https://datasheet.ciiva.com/7679/1697337-7679126.pdf?src-supplier=Element14; ComponentLink4URL: https://datasheet.ciiva.com/16789/70201119-16789112.pdf?src-supplier=Allied+Electronics; ComponentLink4Description: https://datasheet.ciiva.com/16789/70201119-16789112.pdf?src-supplier=Allied+Electronics; ComponentLink5URL: https://datasheet.ciiva.com/7792/125364-7792346.pdf?src-supplier=Element14; ComponentLink5Description: https://datasheet.ciiva.com/7792/125364-7792346.pdf?src-supplier=Element14; ComponentLink6URL: https://datasheet.ciiva.com/22707/1697337-22707754.pdf?src-supplier=Element14; ComponentLink6Description: https://datasheet.ciiva.com/22707/1697337-22707754.pdf?src-supplier=Element14; ComponentLink7URL: https://datasheet.ciiva.com/5541/dcrcwe3-109170-5541375.pdf?src-supplier=Mouser; ComponentLink7Description: https://datasheet.ciiva.com/5541/dcrcwe3-109170-5541375.pdf?src-supplier=Mouser
R7 = R_Gate2: RES SMD 4.7 OHM 5% 1/10W 0603; Manufacturer: Stackpole Electronics; Manufacturer Part Number: RMCF0603JT4R70; Resistance: 4.7R; Power Rating: 100mW; Temperature Coefficient: 200ppm/°C; Supplier 1: Digi-Key; Supplier Part Number 1: RMCF0603JT4R70CT-ND; RoHS: Yes; Category: Chip SMD Resistors; Stock 1: 483; Pricing 1: 1=0,10000, 10=0,02200, 100=0,00880, 1000=0,00396, 2500=0,00344 (USD); Mount: Surface Mount; Case/Package: 0603; Case Code (Metric): 1608; Case Code (Imperial): 0603; Contact Plating: Tin,Matte; Size Code: 0603; Min Operating Temperature: -55°C; Max Operating Temperature: 155°C; Tolerance: 5%; Packaging: Tape and Reel; Resistor Type: Thick Film; Number of Terminations: 2; Max Power Dissipation: 100mW; Features: Automotive AEC-Q200; Series: RMCF; Length: 0.061inch; Width: 0.031inch; Height: 0.022inch; Radiation Hardening: No; Lead Free: Lead Free; RoHS Compliant: Yes; ComponentLink1URL: http://components.arrow.com/part/dataview/50500623S9982757N1174?src-supplier=Arrow+Electronics; ComponentLink1Description: http://components.arrow.com/part/dataview/50500623S9982757N1174?src-supplier=Arrow+Electronics; ComponentLink2URL: https://www.seielect.com/catalog/SEI-RMCF_RMCP.pdf?src-supplier=Avnet; ComponentLink2Description: https://www.seielect.com/catalog/SEI-RMCF_RMCP.pdf?src-supplier=Avnet; ComponentLink3URL: https://www.seielect.com/Catalog/SEI-RMCF_RMCP.pdf?src-supplier=Digi-Key; ComponentLink3Description: https://www.seielect.com/Catalog/SEI-RMCF_RMCP.pdf?src-supplier=Digi-Key; ComponentLink4URL: http://www.seielect.com/Catalog/SEI-RMC.pdf?src-supplier=Future+Electronics; ComponentLink4Description: http://www.seielect.com/Catalog/SEI-RMC.pdf?src-supplier=Future+Electronics; ComponentLink5URL: https://www.seielect.com/catalog/SEI-Packaging.pdf?src-supplier=Digi-Key; ComponentLink5Description: https://www.seielect.com/catalog/SEI-Packaging.pdf?src-supplier=Digi-Key
R8 = R_Drain2: RES SMD 2.32K OHM 1% 1/10W 0603; Manufacturer: Stackpole Electronics; Manufacturer Part Number: RMCF0603FT2K32; Resistance: 2.32kR; Max Power Dissipation: 100mW; Temperature Coefficient: 100ppm/°C; Supplier 1: Digi-Key; Supplier Part Number 1: RMCF0603FT2K32CT-ND; RoHS: Yes; Category: Chip SMD Resistors; Stock 1: 22121; Pricing 1: 1=0,10000, 10=0,01700, 100=0,00680, 1000=0,00305, 2500=0,00264 (USD); Mount: Surface Mount; Case/Package: 0603; Case Code (Metric): 1608; Case Code (Imperial): 0603; Contact Plating: Tin,Matte; Min Operating Temperature: -55°C; Max Operating Temperature: 155°C; Packaging: Tape and Reel; Tolerance: 1%; Resistor Type: Thick Film; Number of Terminations: 2; Features: Automotive AEC-Q200; Series: RMCF; Length: 0.061inch; Width: 0.031inch; Height: 0.022inch; Radiation Hardening: No; Lead Free: Lead Free; RoHS Compliant: Yes; ComponentLink1URL: https://www.seielect.com/Catalog/SEI-RMCF_RMCP.pdf?src-supplier=Digi-Key; ComponentLink1Description: https://www.seielect.com/Catalog/SEI-RMCF_RMCP.pdf?src-supplier=Digi-Key; ComponentLink2URL: https://www.seielect.com/catalog/SEI-RMCF_RMCP.pdf?src-supplier=Avnet; ComponentLink2Description: https://www.seielect.com/catalog/SEI-RMCF_RMCP.pdf?src-supplier=Avnet